# EAGLE design honda_bosch_c (EAGLE 9.6.2)
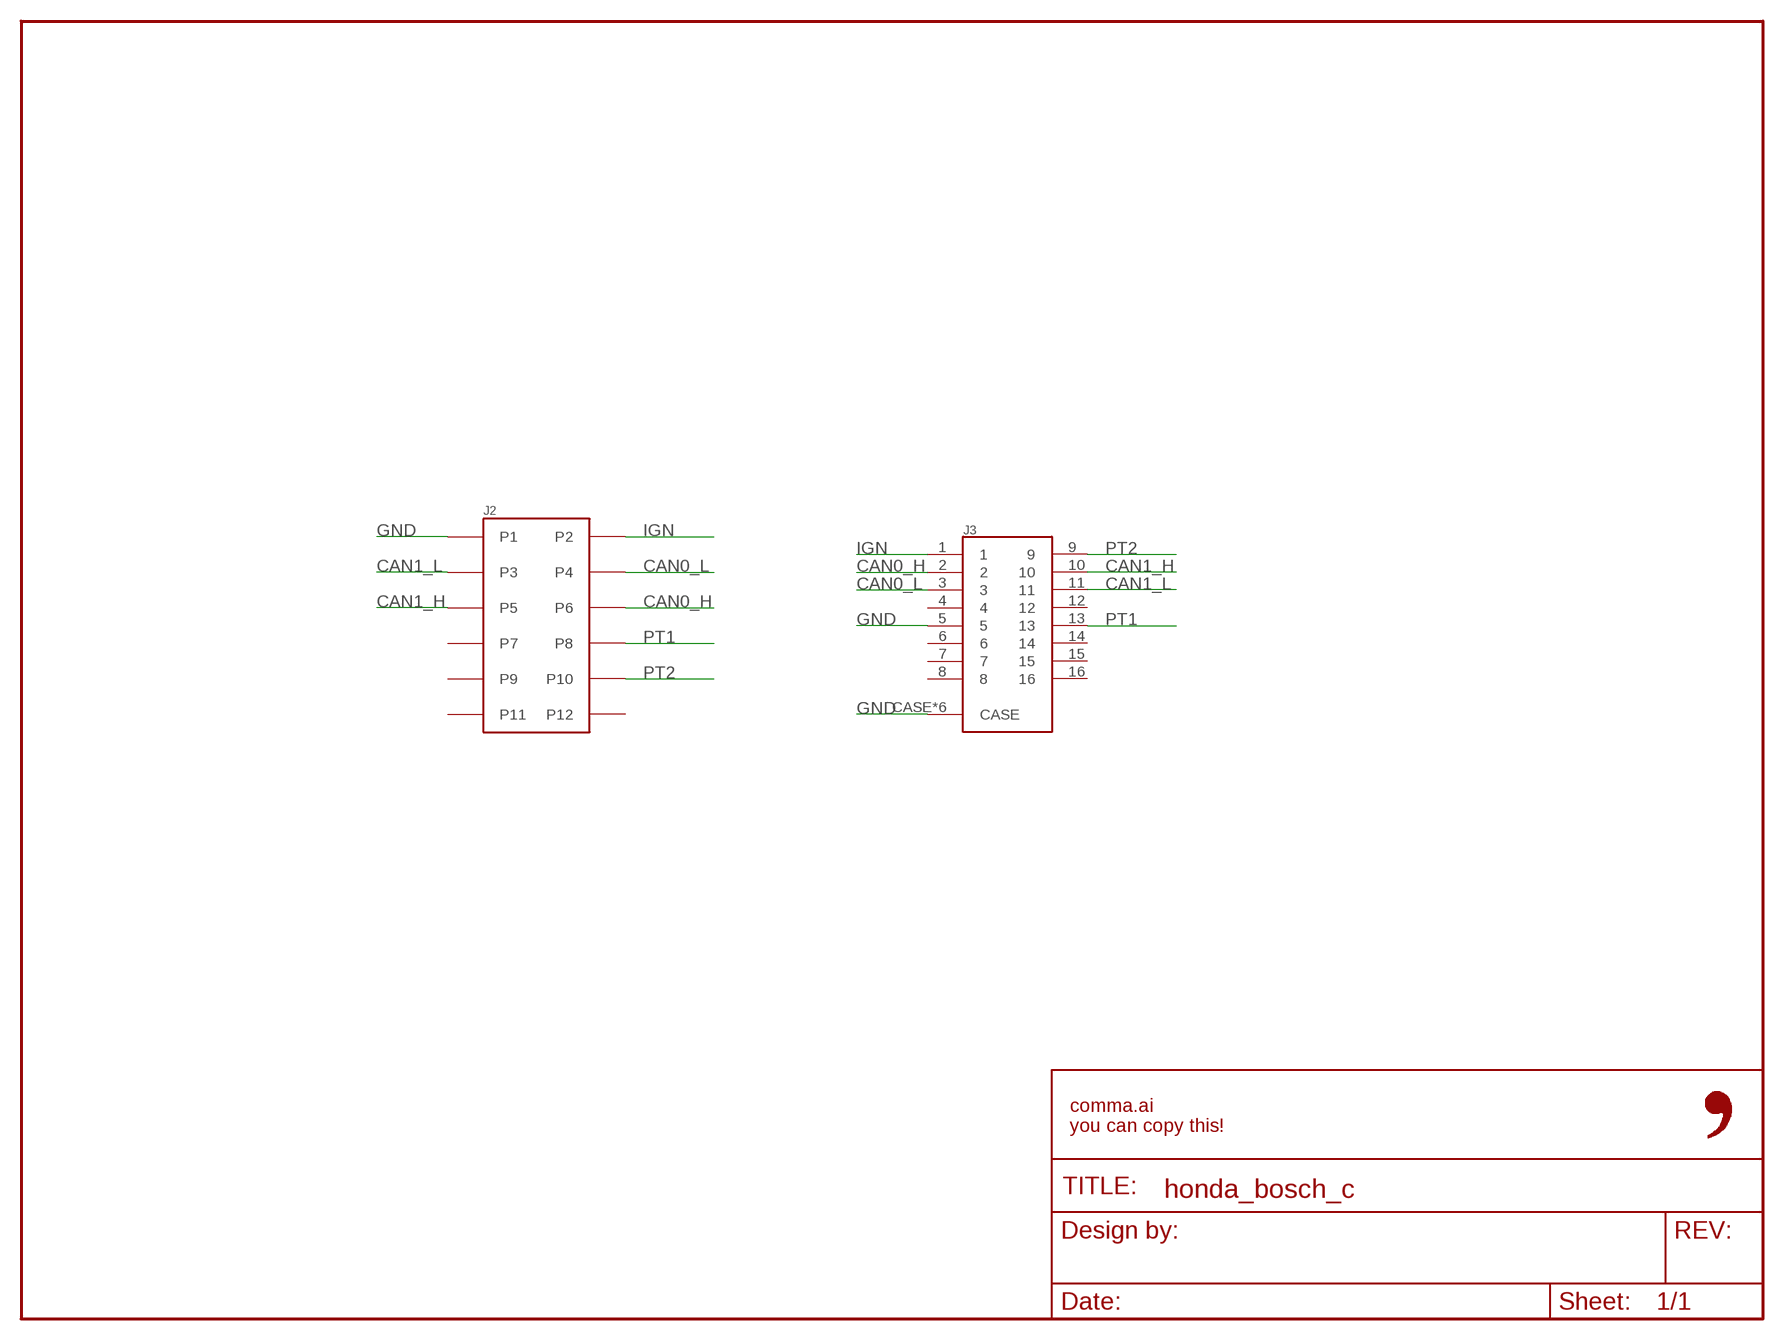
[diagram p0: schematic, sheet 1]

## Parts
FRAME1  FRAME-LETTER-OPENNO_PACKAGE  [DUMMY]
J2  5018761240  [5018761240]
J3  GT25H2-16DP-2.2H  [GT25H2-16DP-2.2H]

## Nets
CAN0_H: J2.P6 J3.2
CAN0_L: J2.P4 J3.3
CAN1_H: J2.P5 J3.10
CAN1_L: J2.P3 J3.11
GND: J2.P1 J3.5 J3.CASE J3.CASE2(CASE) J3.CASE3(CASE) J3.CASE4(CASE) J3.CASE5(CASE) J3.CASE6(CASE)
IGN: J2.P2 J3.1
PT1: J2.P8 J3.13
PT2: J2.P10 J3.9
Unconnected: J2.P7 J2.P9 J2.P11 J2.P12 J3.4 J3.6 J3.7 J3.8 J3.12 J3.14 J3.15 J3.16

## Library data of the parts
FRAME1 = comma.ai:FRAME-LETTER-OPEN: Schematic Frame - Letter Standard 8.5x11 US Letter frame; DESIGNER: Nobody; VERSION: v01
J2 = comma.ai:5018761240; CPN: CAI-HARNESS-MOLEX-5018761240
J3 = comma.ai:GT25H2-16DP-2.2H; CPN: CAI-GT25H2-16DP-2.2H

## Board
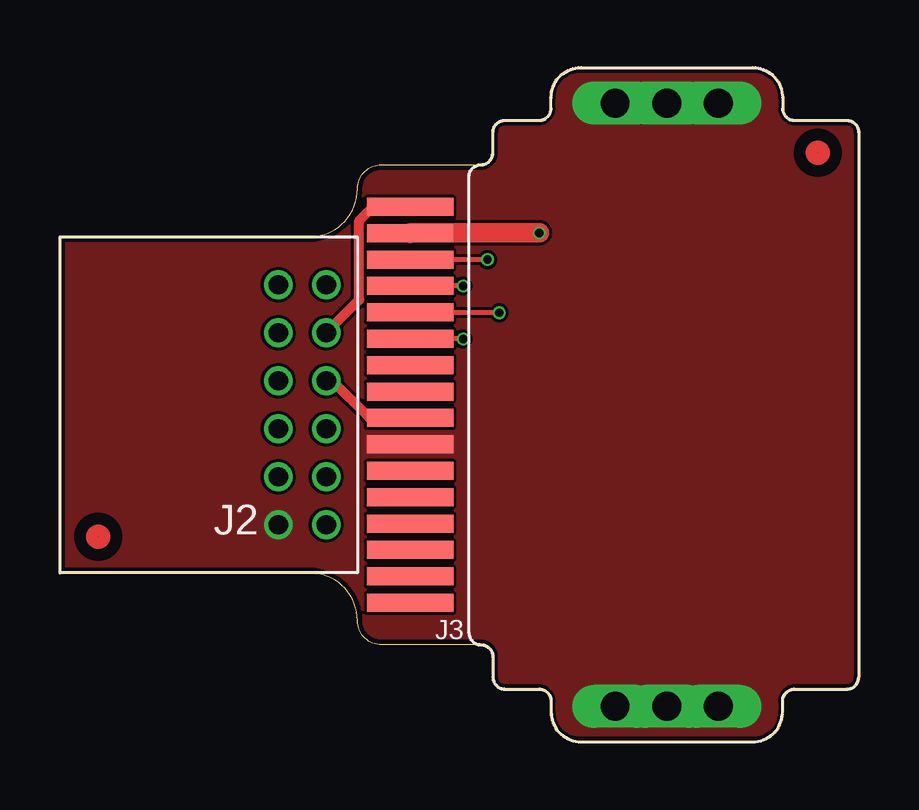
[diagram p1: board, top side]
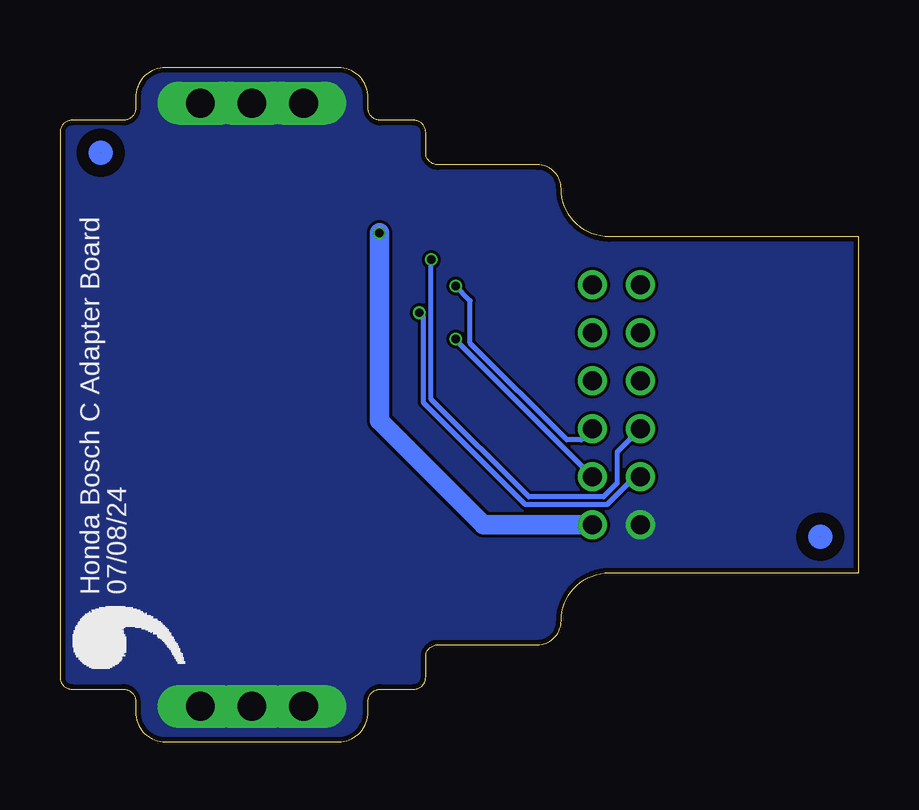
[diagram p2: board, bottom side, seen from below]

Size 33.3 x 28.1 mm. Coordinates in mm from the lower left corner, seen from the top.
Outline: 12.4,5.05 arc90 10.4,7.05 0,7.05 0,21.05 10.4,21.05 arc90 12.4,23.05 arc-90 13.4,24.05 17.55,24.05 arc90 18.05,24.55 18.05,25.4 arc-90 18.55,25.9 19.95,25.9 arc90 20.45,26.4 20.45,26.85 arc-90 21.7,28.1 28.9,28.1 arc-90 30.15,26.85 30.15,26.4 arc90 30.65,25.9 32.8,25.9 arc-90 33.3,25.4 33.3,2.7 arc-90 32.8,2.2 30.65,2.2 arc90 30.15,1.7 30.15,1.25 arc-90 28.9,0 21.7,0 arc-90 20.45,1.25 20.45,1.7 arc90 19.95,2.2 18.55,2.2 arc-90 18.05,2.7 18.05,3.55 arc90 17.55,4.05 13.4,4.05 arc-90 12.4,5.05
Copper layers (1*16): Top 0.035mm / dielectric 1.5mm / Bottom 0.035mm
Design rules "jlcpcb_2layer": minimum track width 5mil, minimum drill 12mil, track to track 5mil, track to pad 5mil, pad to pad 5mil, via to via 5mil, smd to smd 5mil, copper to edge 8mil, drill to drill 8mil, minimum pad ring 3mil, minimum via ring 3mil, stop-mask expansion 4mm, vias tented up to drill 20mil, thermal gap 10mil

### Footprints (pad centres in the part's own frame; a part is rotated, then mirrored left to right if it is on the bottom)
5018761240 = drill 0.8: P1 5,-1; P2 5,1; P3 3,-1; P4 3,1; P5 1,-1; P6 1,1; P7 -1,-1; P8 -1,1; P9 -3,-1; P10 -3,1; P11 -5,-1; P12 -5,1
GT25H2-16DP-2.2H = smd 0.75 x 3.6: 1 7.15,10.7; 2 4.95,10.7; 3 2.75,10.7; 4 0.55,10.7; 5 -1.65,10.7; 6 -3.85,10.7; 7 -6.05,10.7; 8 -8.25,10.7; 9 8.25,10.7; 10 6.05,10.7; 11 3.85,10.7; 12 1.65,10.7; 13 -0.55,10.7; 14 -2.75,10.7; 15 -4.95,10.7; 16 -7.15,10.7 | drill 1.2 long: CASE -12.565,0; CASE2 -12.565,2.15; CASE3 -12.565,-2.15; CASE4 12.565,0; CASE5 12.565,2.15; CASE6 12.565,-2.15

### Placement (x,y rotation side)
E$1  [LOGO]  27.79,2.38 90 bottom
FRAME1  10.1,14.05 180 top
J2  10.1,14.05 270 top
J3  25.3,14.05 90 top
U$1  [FIDUCIAL]  31.6,24.55 0 top
U$3  [FIDUCIAL]  1.6,8.55 0 top

### Tracks (layer width: path | path; a pad name or v marks a point on that pad's centre or on a via)
CAN0_H  (via drill 0.35)
  Top 0.203: v16.81,19 J3.2
  Bottom 0.203: J2.P6 11.56,12.59 12.17,12.59 16.2,16.61 16.2,18.39 v16.81,19
CAN0_L  (via drill 0.35)
  Top 0.203: v16.81,16.79 J3.3
  Bottom 0.203: J2.P4 16.81,16.76 v16.81,16.79
CAN1_H  (via drill 0.35)
  Top 0.203: v17.82,20.09 J3.10
  Bottom 0.203: J2.P5 10.07,12.08 10.07,10.77 10.63,10.21 13.76,10.21 17.82,14.28 v17.82,20.09
CAN1_L  (via drill 0.35)
  Top 0.203: v18.31,17.89 14.61,17.89 J3.11
  Bottom 0.203: J2.P3 9.33,11.05 10.5,9.88 13.89,9.88 18.15,14.14 18.15,17.73 v18.31,17.89
GND
  pour Top (no thermals): -0.9,29.05 35.1,29.05 35.1,-0.95 -0.9,-0.95
  pour Bottom (no thermals): -1.9,30.05 36.1,30.05 36.1,-1.95 -1.9,-1.95
IGN  (via drill 0.35)
  Top 0.813: v19.98,21.21 14.61,21.21 J3.1
  Bottom 0.813: J2.P2 15.64,9.05 19.98,13.39 v19.98,21.21
PT1
  Top 0.406: J2.P8 11.35,15.05 12.9,13.5 J3.13
PT2
  Top 0.406: J2.P10 12.47,18.42 12.47,21.71 13.06,22.3 J3.9

### Text on the board
bPlace: 07/08/24 | Honda Bosch C Adapter Board